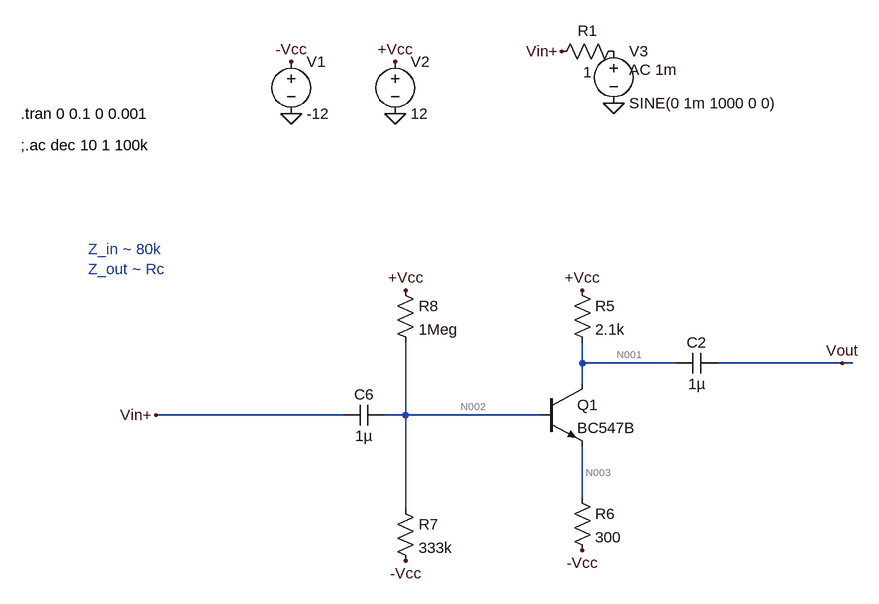
[diagram p0: schematic BJT.asc]
BJT.asc, the LTspice schematic file:
Version 4
SHEET 1 2532 912
WIRE 288 192 288 160
WIRE 432 192 288 192
WIRE 688 192 496 192
WIRE 704 192 688 192
WIRE 288 224 288 192
WIRE -80 272 -368 272
WIRE 16 272 16 160
WIRE 16 272 -16 272
WIRE 224 272 16 272
WIRE 288 400 288 320
WIRE 16 416 16 272
FLAG -160 -192 0
FLAG 0 -192 0
FLAG -160 -272 -Vcc
FLAG 0 -272 +Vcc
FLAG 336 -208 0
FLAG 256 -288 Vin+
FLAG 16 80 +Vcc
FLAG 288 80 +Vcc
FLAG 16 496 -Vcc
FLAG 288 480 -Vcc
FLAG 688 192 Vout
FLAG -368 272 Vin+
SYMBOL voltage -160 -288 R0
WINDOW 123 0 0 Left 0
WINDOW 39 0 0 Left 0
SYMATTR InstName V1
SYMATTR Value -12
SYMBOL voltage 0 -288 R0
WINDOW 123 0 0 Left 0
WINDOW 39 0 0 Left 0
SYMATTR InstName V2
SYMATTR Value 12
SYMBOL voltage 336 -304 R0
WINDOW 123 24 44 Left 2
WINDOW 39 0 0 Left 0
SYMATTR Value2 AC 1m
SYMATTR InstName V3
SYMATTR Value SINE(0 1m 1000 0 0)
SYMBOL res 352 -304 R90
WINDOW 0 0 56 VBottom 2
WINDOW 3 32 56 VTop 2
SYMATTR InstName R1
SYMATTR Value 1
SYMBOL npn 224 224 R0
SYMATTR InstName Q1
SYMATTR Value BC547B
SYMBOL res 272 64 R0
SYMATTR InstName R5
SYMATTR Value 2.1k
SYMBOL res 272 384 R0
SYMATTR InstName R6
SYMATTR Value 300
SYMBOL res 0 400 R0
SYMATTR InstName R7
SYMATTR Value 333k
SYMBOL res 0 64 R0
SYMATTR InstName R8
SYMATTR Value 1Meg
SYMBOL cap 496 176 R90
WINDOW 0 0 32 VBottom 2
WINDOW 3 32 32 VTop 2
SYMATTR InstName C2
SYMATTR Value 1µ
SYMBOL cap -16 256 R90
WINDOW 0 0 32 VBottom 2
WINDOW 3 32 32 VTop 2
SYMATTR InstName C6
SYMATTR Value 1µ
TEXT -576 -192 Left 2 !.tran 0 0.1 0 0.001
TEXT -576 -144 Left 2 !;.ac dec 10 1 100k
TEXT -472 16 Left 2 ;Z_in ~ 80k\nZ_out ~ Rc

The netlist it stands for:
* BJT.asc
V1 -Vcc 0 -12
V2 +Vcc 0 12
V3 P001 0 SINE(0 1m 1000 0 0) AC 1m
R1 P001 Vin+ 1
Q1 N001 N002 N003 0 BC547B
R5 +Vcc N001 2.1k
R6 N003 -Vcc 300
R7 N002 -Vcc 333k
R8 +Vcc N002 1Meg
C2 Vout N001 1µ
C6 N002 Vin+ 1µ
.model NPN NPN
.model PNP PNP
.lib standard.bjt
.tran 0 0.1 0 0.001
;.ac dec 10 1 100k
* Z_in ~ 80k
* Z_out ~ Rc
.backanno
.end

* Results of the author's LTspice run, read from the files saved beside the schematic
* Operating Point, zero values left out:
*   V(-vcc) = -12 V
*   V(+vcc) = 12 V
*   V(n001) = 1.514 V
*   V(n002) = -9.818 V
*   V(n003) = -10.5 V
*   V(vout) = 1.514 µV
*   Ic(Q1) = 4.993 mA
*   Ib(Q1) = 15.27 µA
*   Ie(Q1) = -5.009 mA
*   I(R8) = 21.82 µA
*   I(R7) = 6.551 µA
*   I(R6) = 5.009 mA
*   I(R5) = 4.993 mA
*   I(V2) = -5.015 mA
*   I(V1) = 5.015 mA